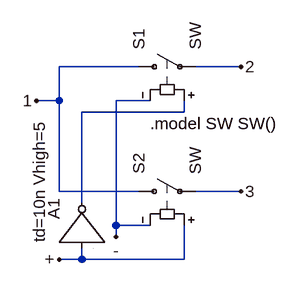
[diagram p0: schematic SPDT.asc]
SPDT.asc, the LTspice schematic file:
Version 4
SHEET 1 880 680
WIRE 192 112 80 112
WIRE 336 112 272 112
WIRE 80 160 80 112
WIRE 80 160 48 160
WIRE 208 160 160 160
WIRE 256 176 256 160
WIRE 256 176 112 176
WIRE 80 288 80 160
WIRE 192 288 80 288
WIRE 336 288 272 288
WIRE 112 304 112 176
WIRE 160 336 160 160
WIRE 208 336 160 336
WIRE 160 352 160 336
WIRE 112 384 112 368
WIRE 112 384 80 384
WIRE 256 384 256 336
WIRE 256 384 112 384
FLAG 48 160 1
FLAG 336 112 2
FLAG 336 288 3
FLAG 160 352 -
FLAG 80 384 +
SYMBOL sw 176 112 R270
SYMATTR InstName S1
SYMBOL sw 176 288 R270
SYMATTR InstName S2
SYMBOL Digital\\inv 48 368 R270
WINDOW 3 8 4 Left 2
SYMATTR Value td=10n Vhigh=5
SYMATTR InstName A1
TEXT 208 192 Left 2 !.model SW SW()

The netlist it stands for:
* SPDT.asc
S1 1 2 N001 - SW
S2 1 3 + - SW
A1 + 0 0 0 0 N001 0 0 BUF td=10n Vhigh=5
.model SW SW()
.backanno
.end